# EasyEDA schematic 1-Schematic_LED Matrix.json

## Sheets
1 Audio: TITLE: Audio; REV: 1.0; Date: 2019-05-28; Sheet: 1/1; Drawn By: alecamar; Company: N/A
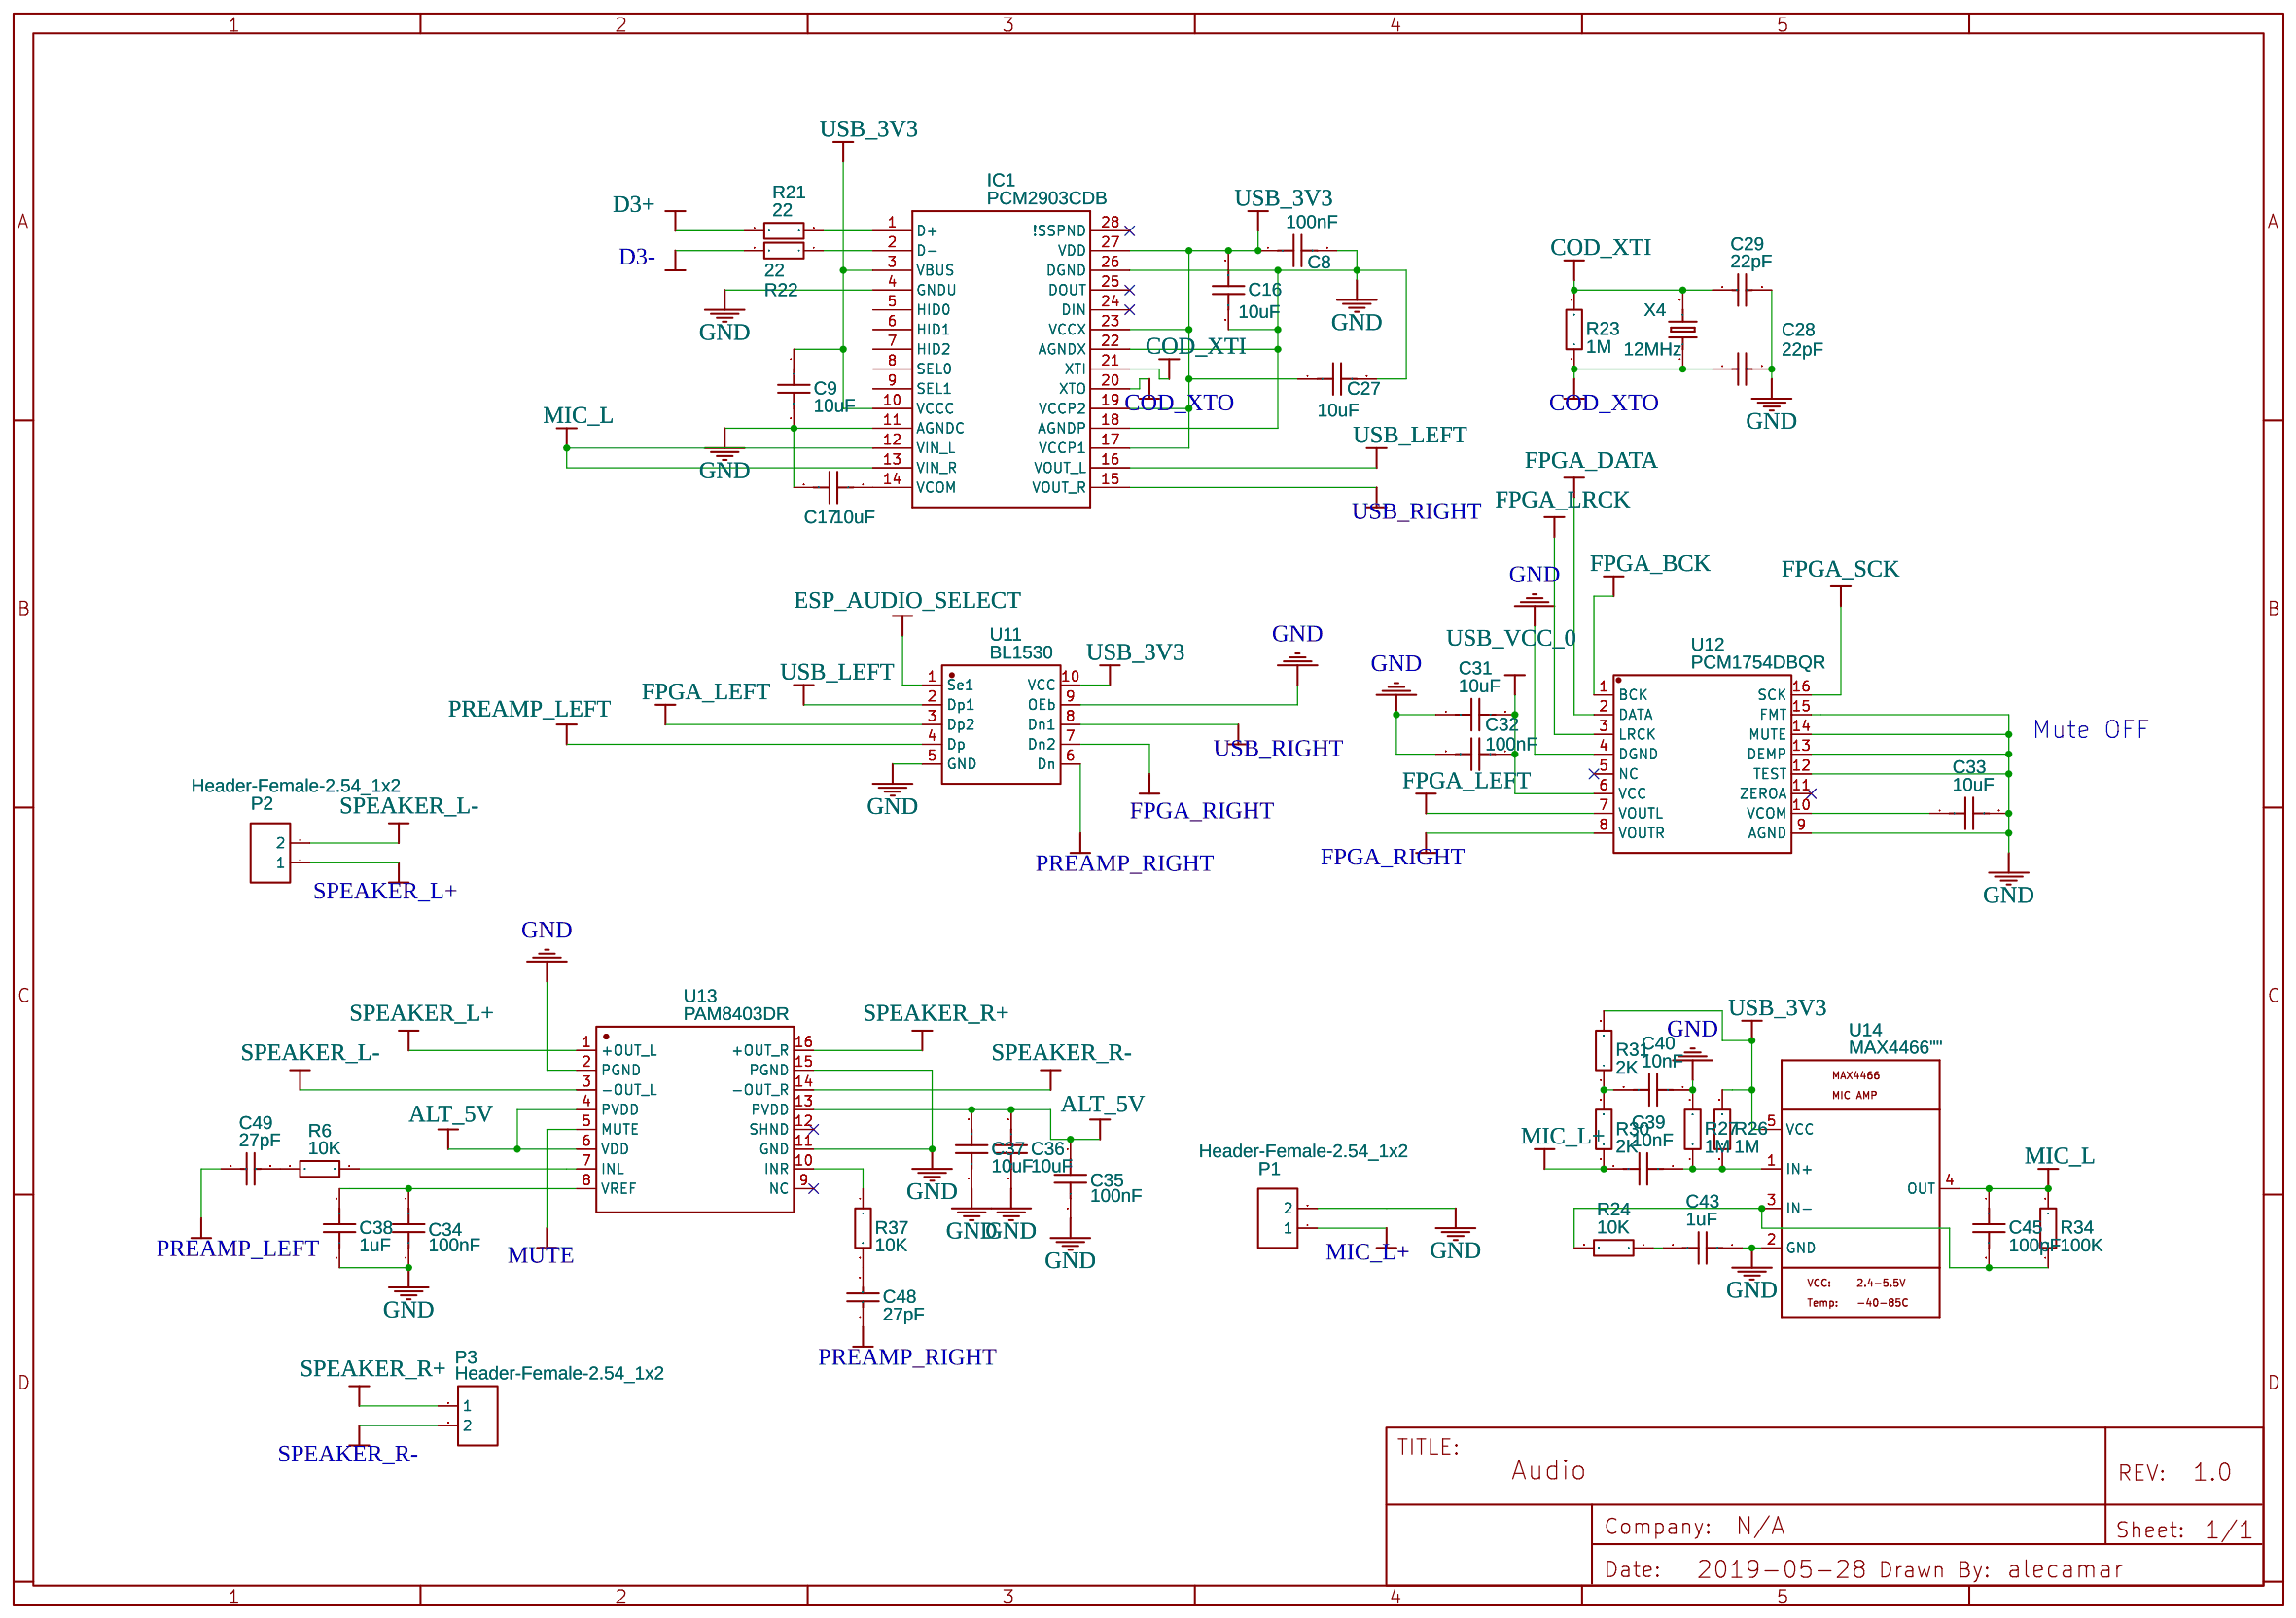
[diagram p0: Audio]
2 ESP: TITLE: ESP; Date: 2019-05-27
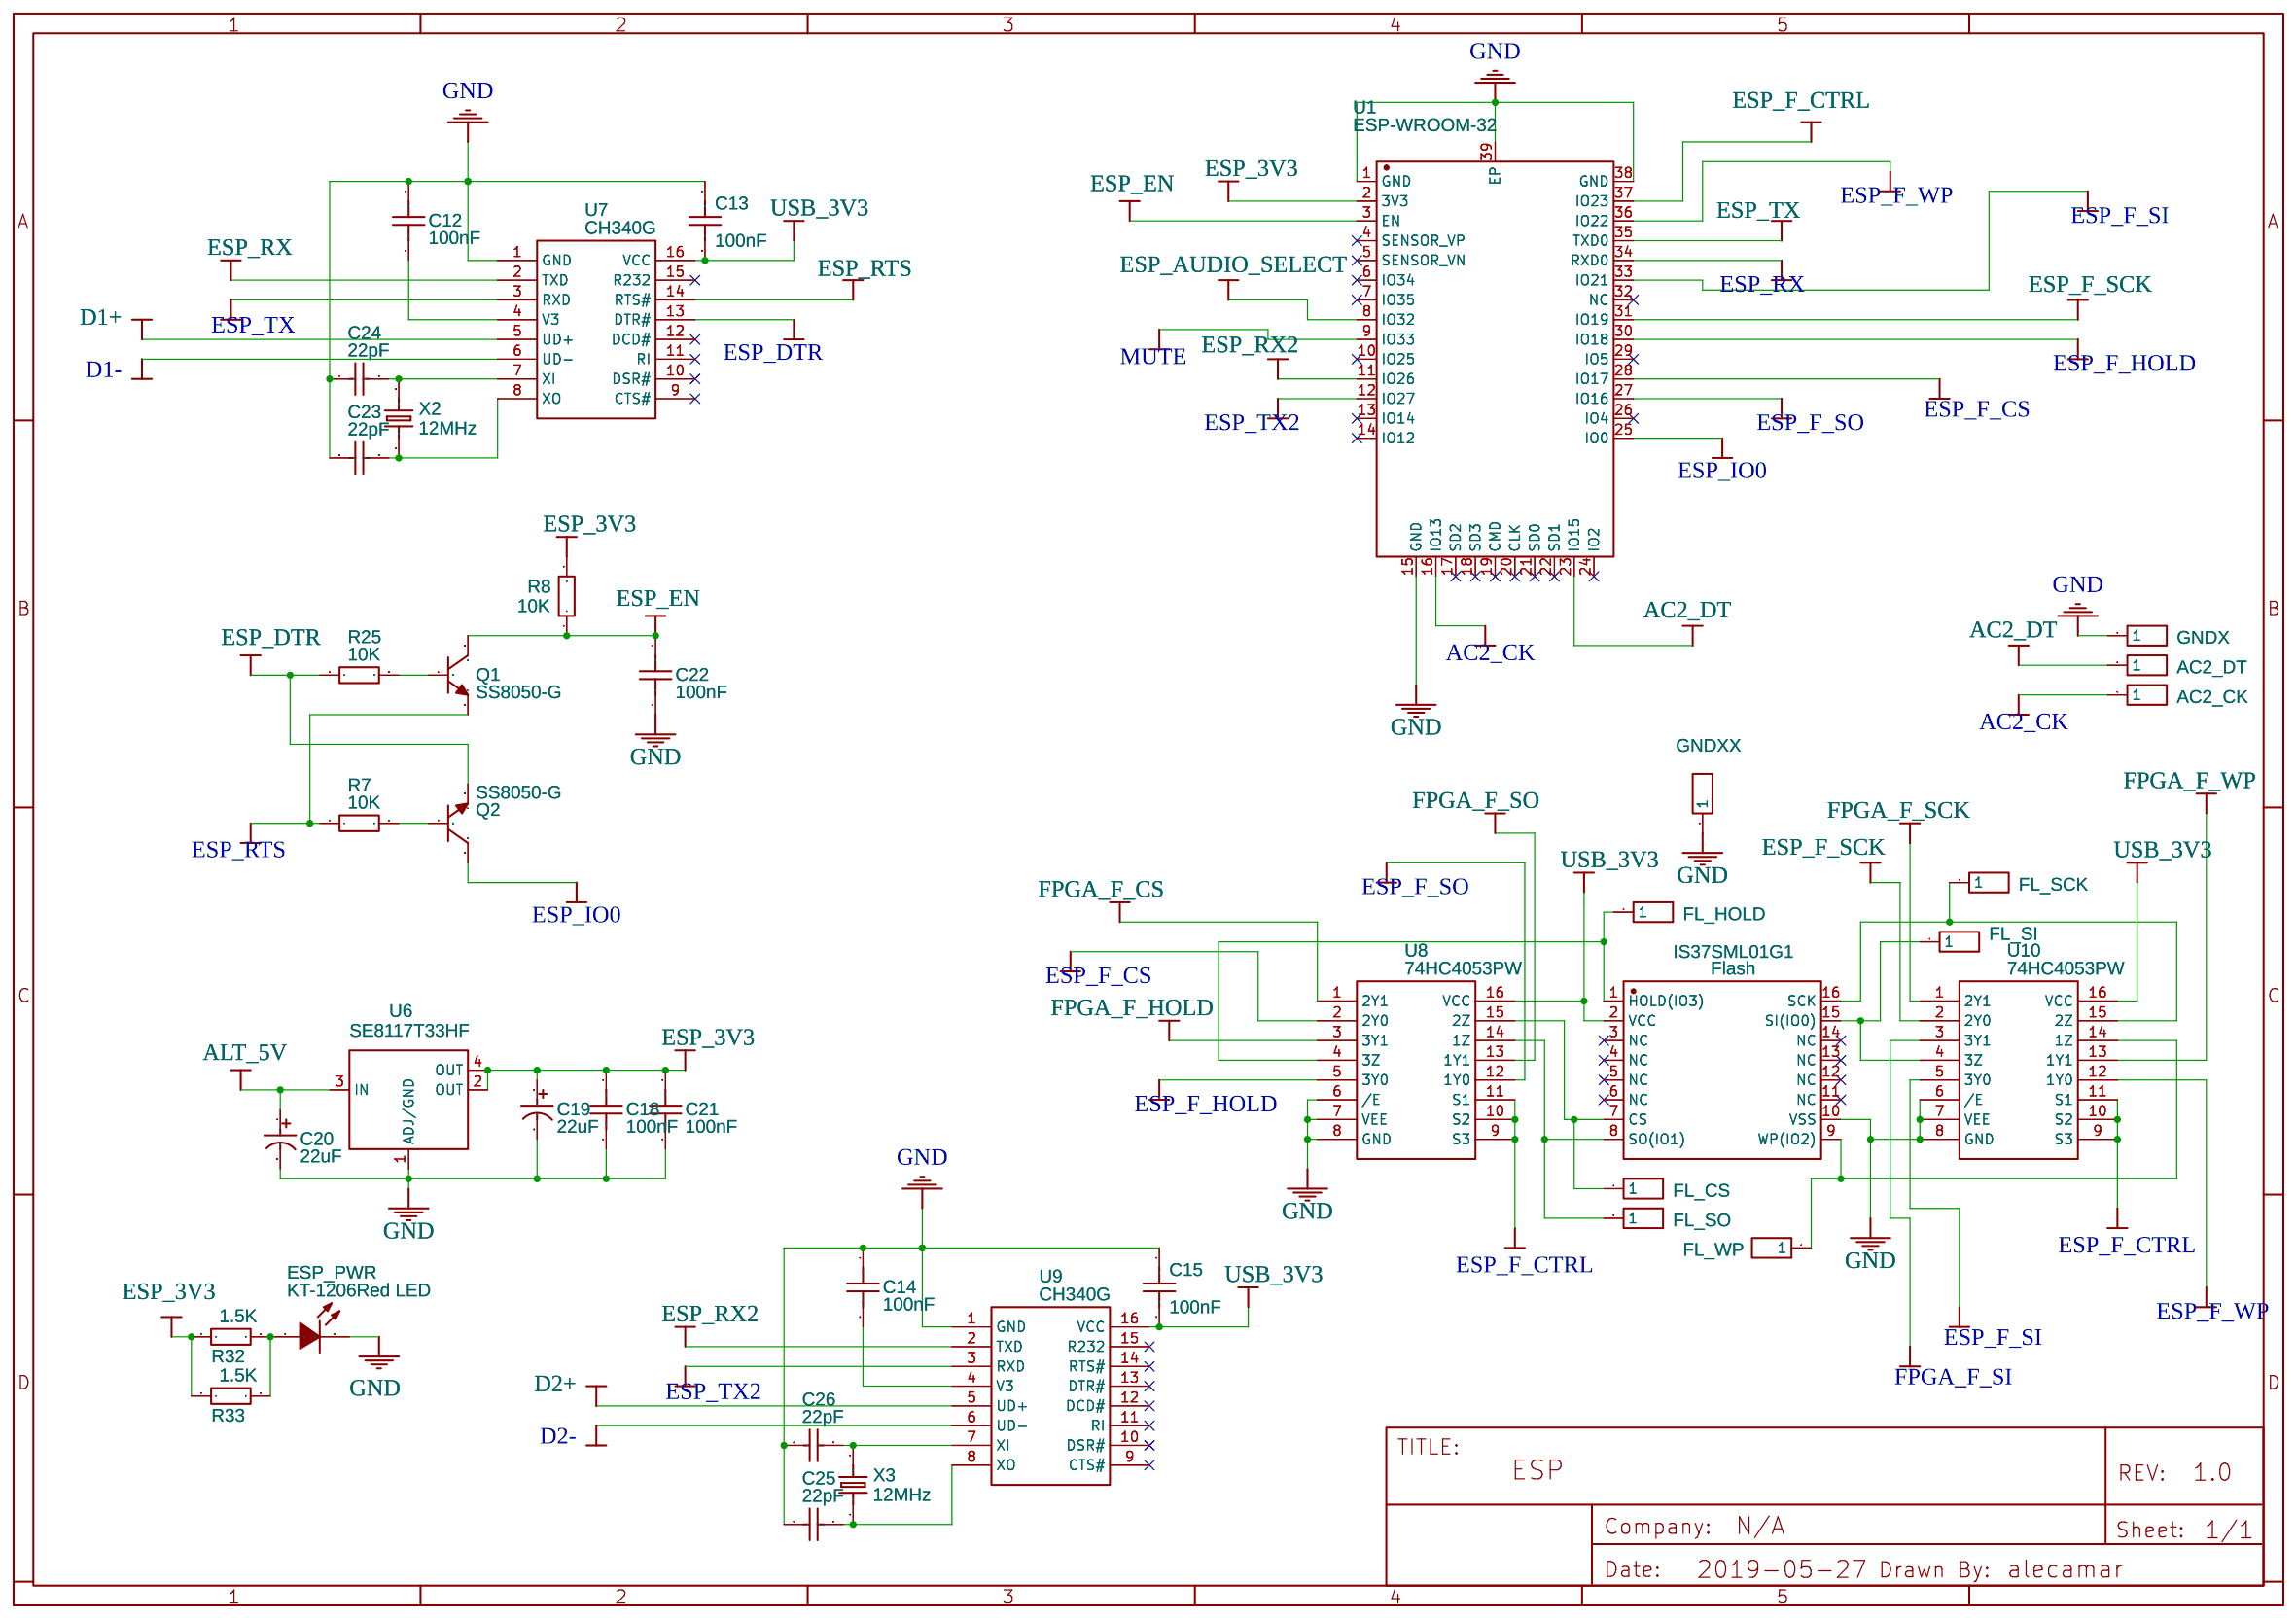
[diagram p1: ESP]
3 FPGA: TITLE: FPGA - MAX8; Date: 2019-05-24
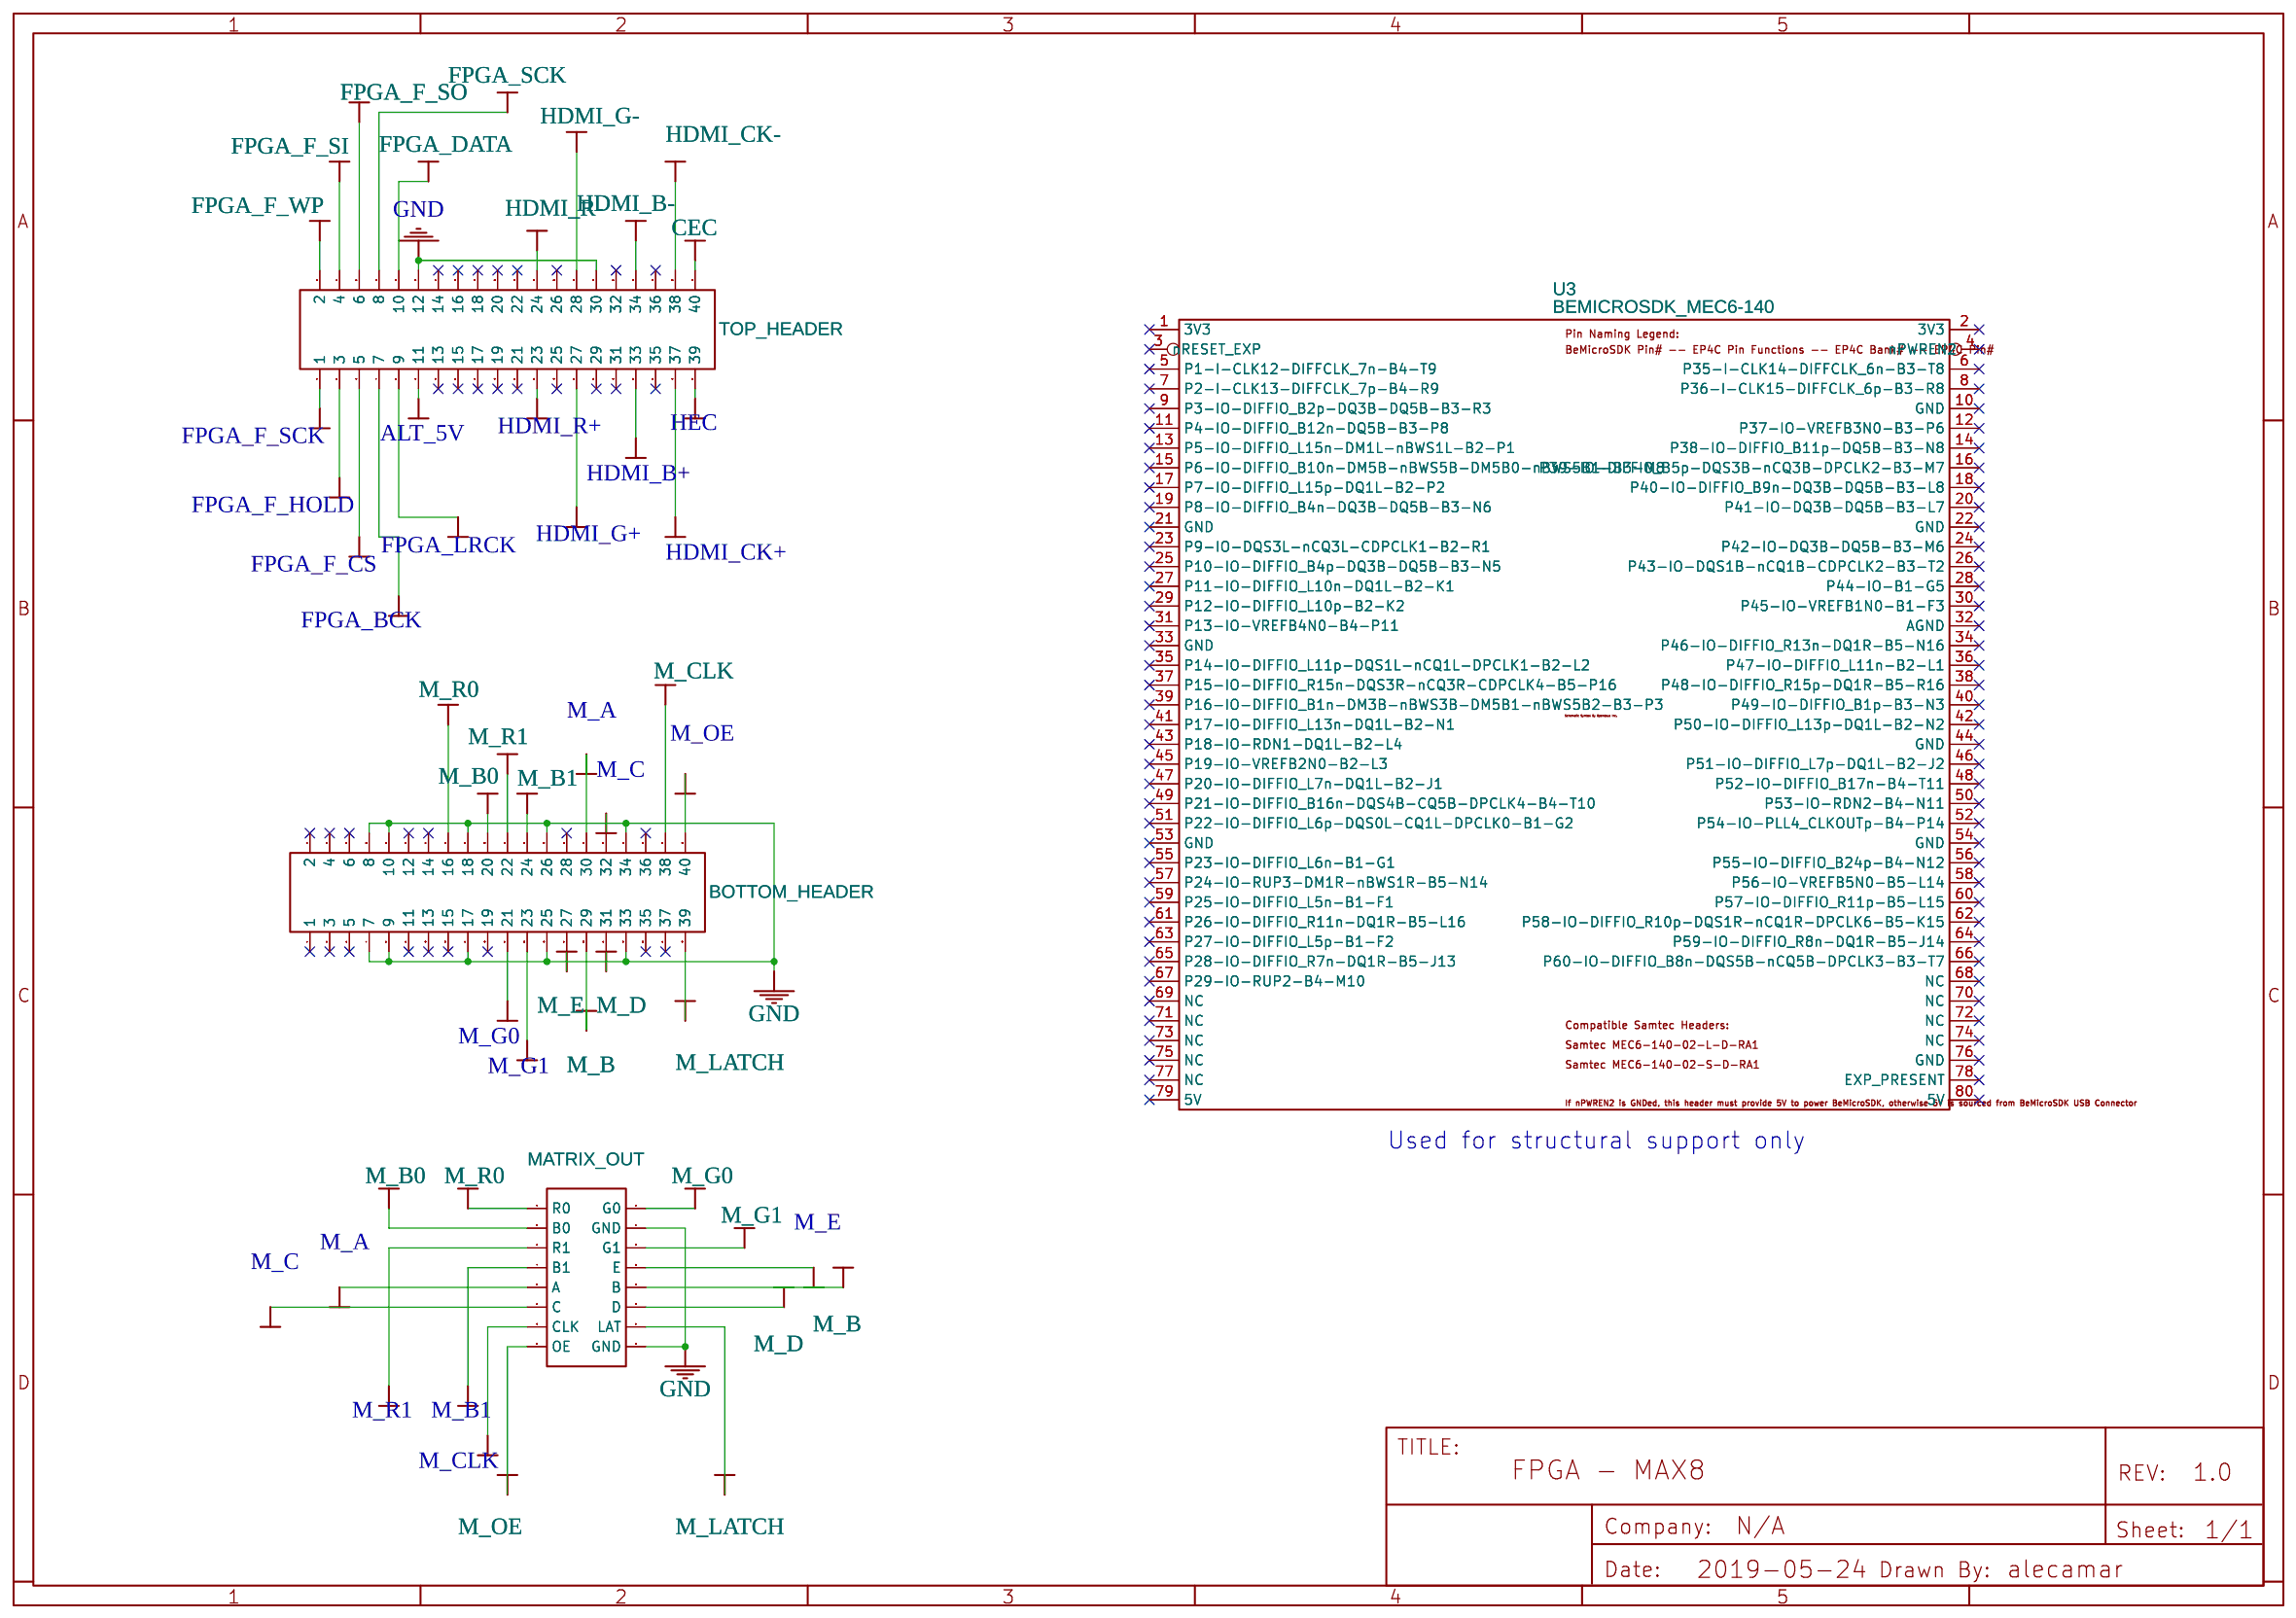
[diagram p2: FPGA]
4 IO: TITLE: HDMI; Date: 2019-05-20
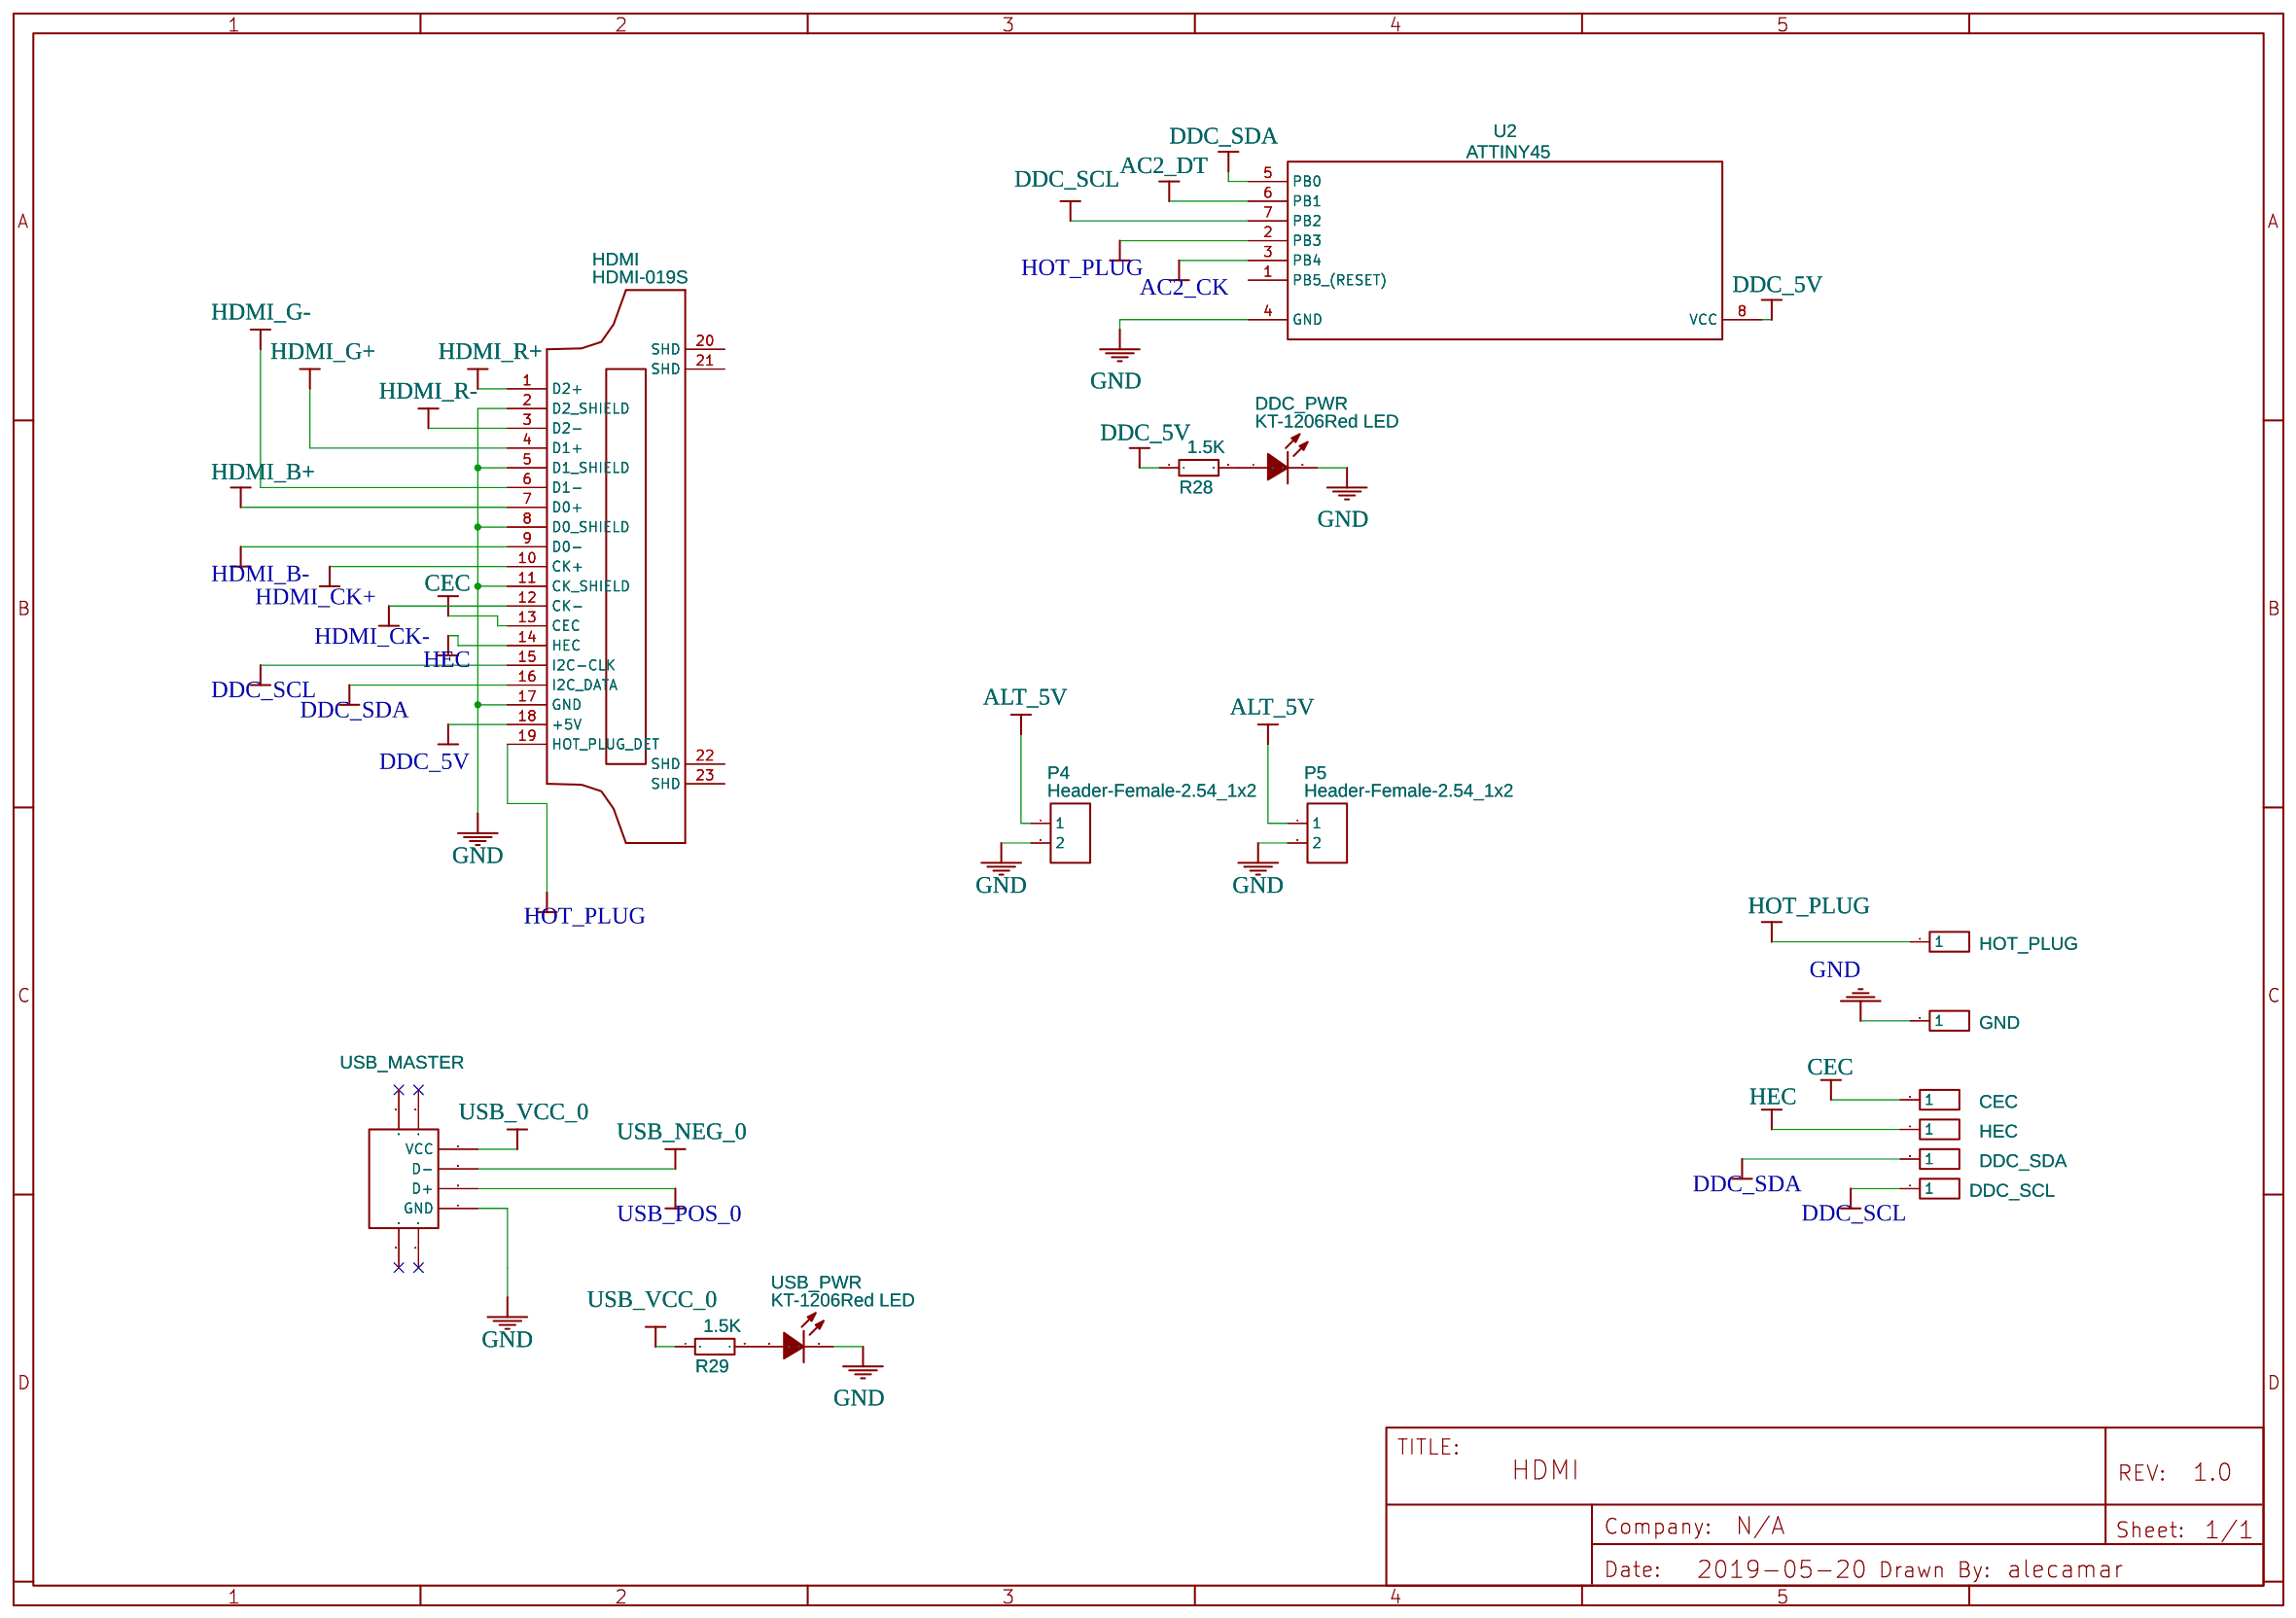
[diagram p3: IO]
5 USB_HUB: TITLE: USB_HUB; Date: 2019-05-27
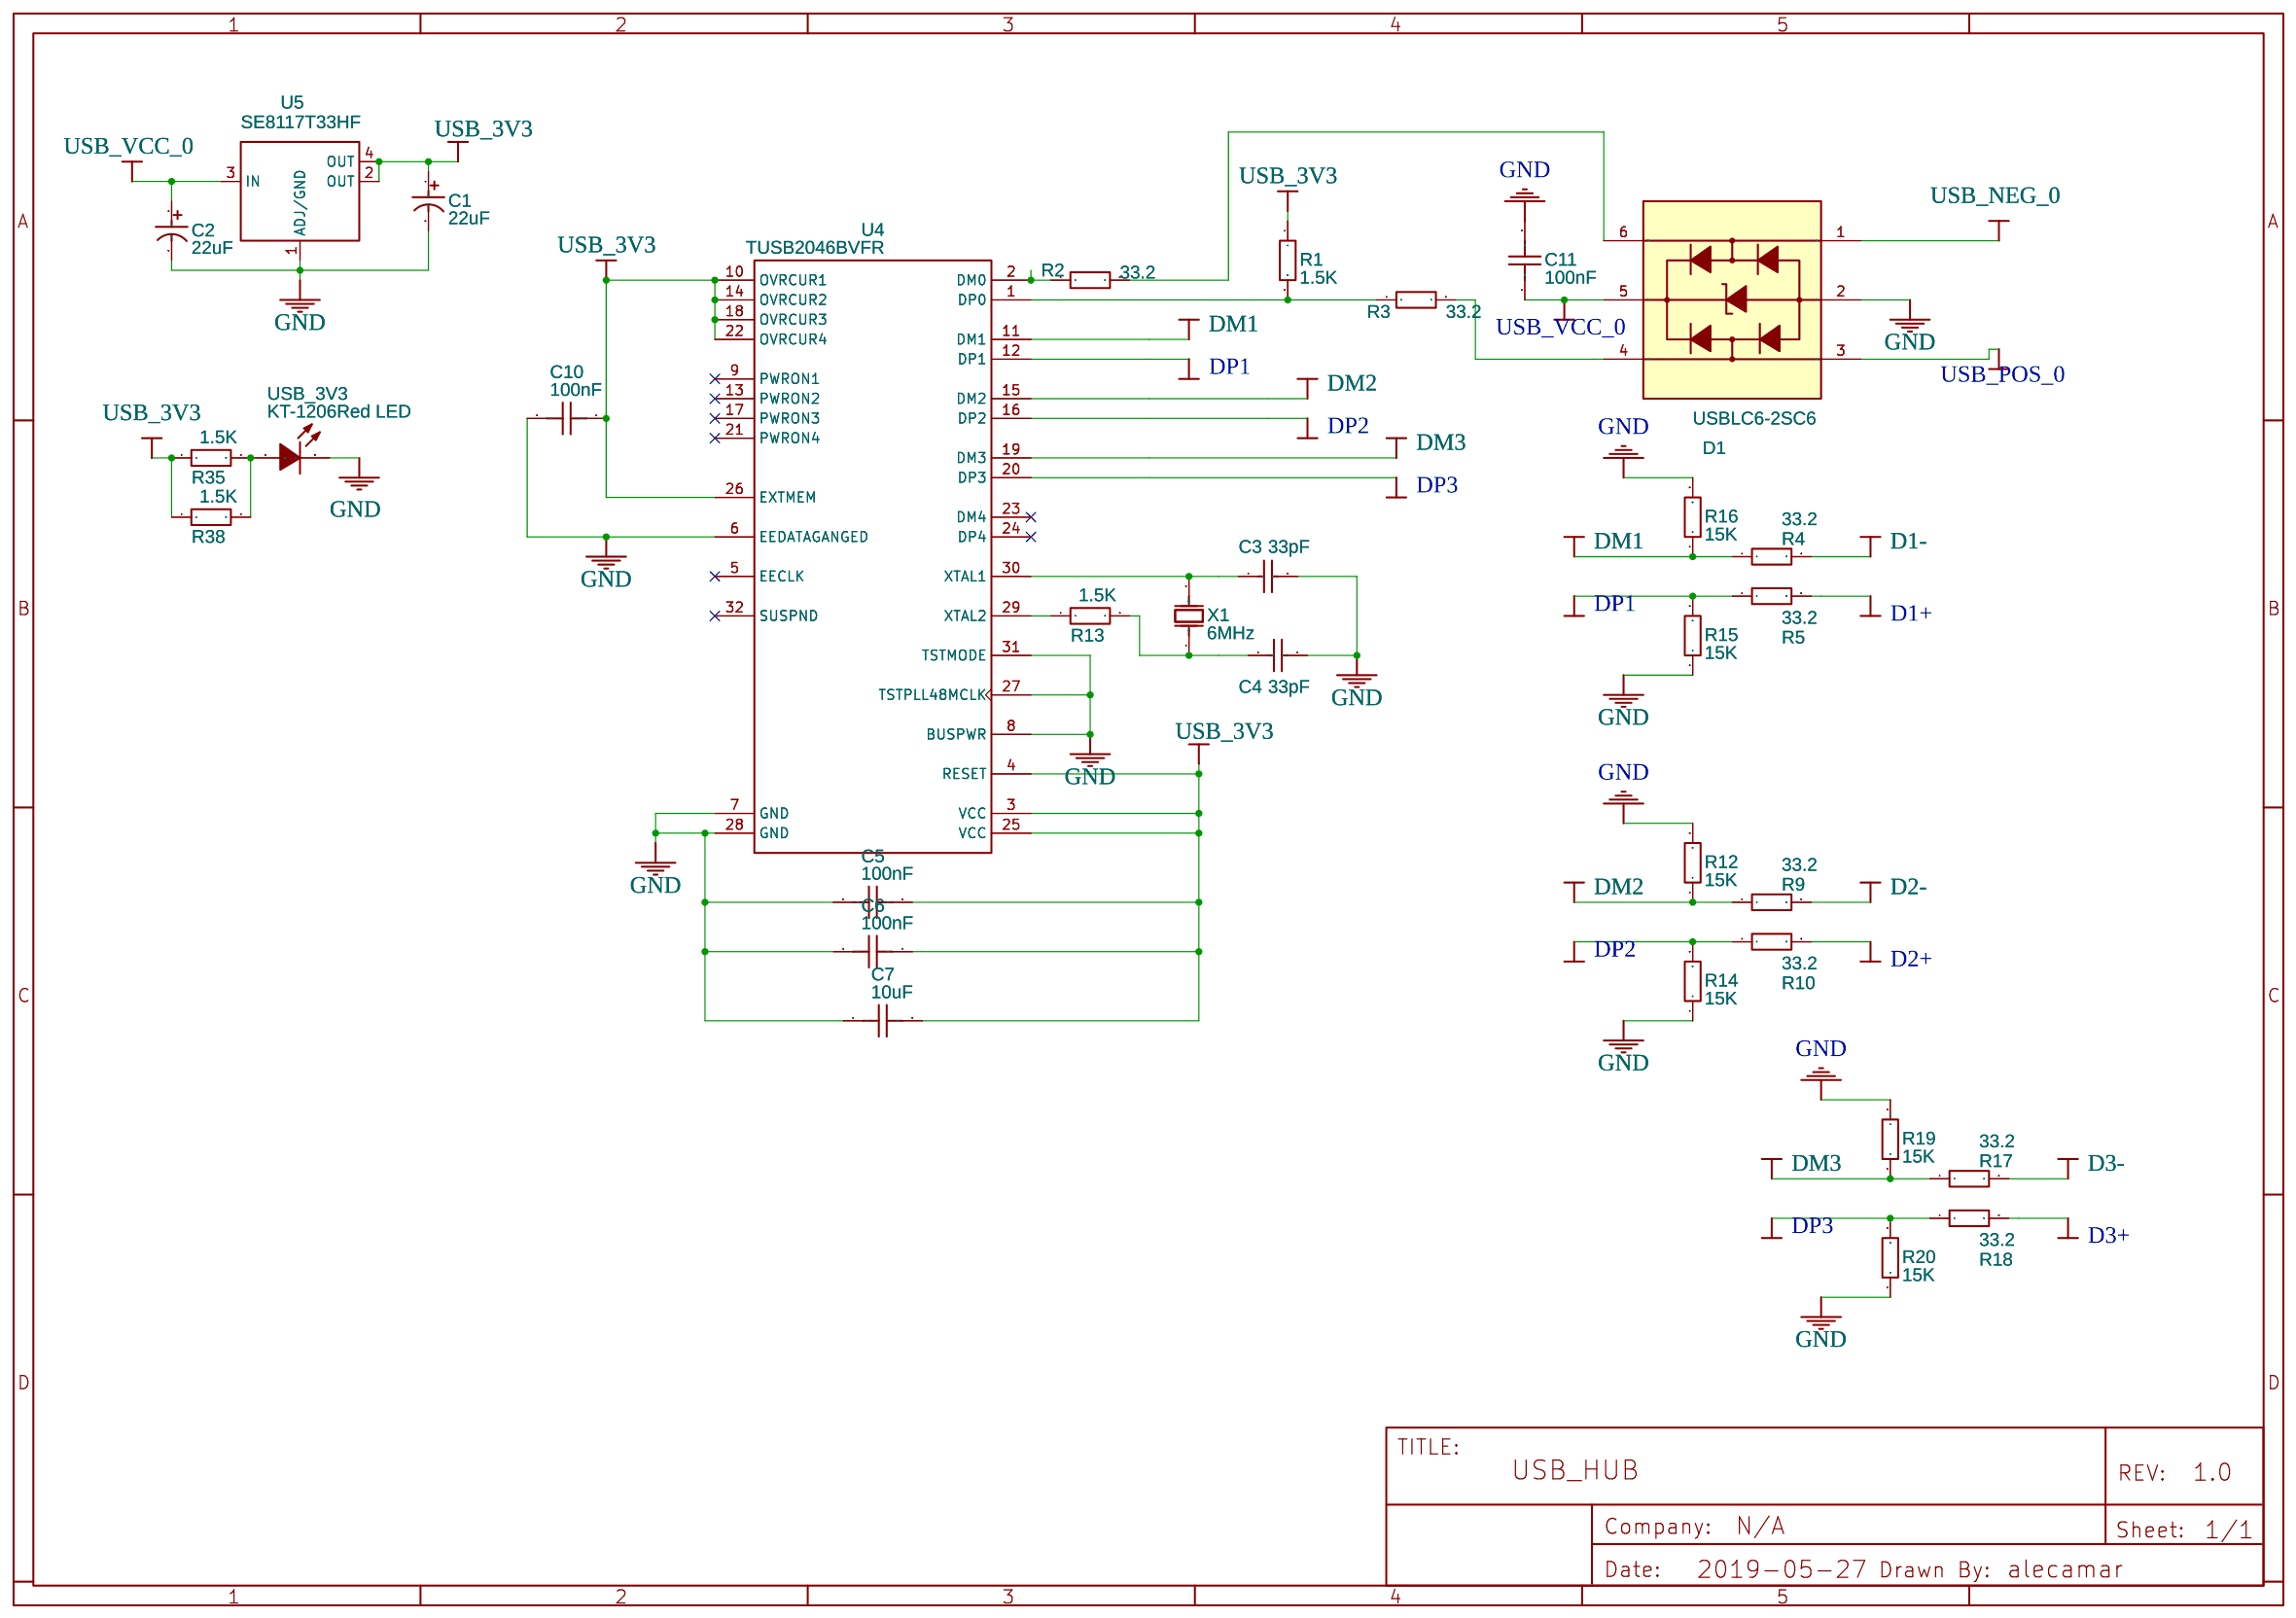
[diagram p4: USB_HUB]

## Parts
sheet Audio
C8  100nF  [1206]
C9  10uF  [1206]
C16  10uF  [1206]
C17  10uF  [1206]
C27  10uF  [1206]
C28  22pF  [1206]
C29  22pF  [1206]
C31  10uF  [1206]
C32  100nF  [1206]
C33  10uF  [1206]
C34  100nF  [1206]
C35  100nF  [1206]
C36  10uF  [1206]
C37  10uF  [1206]
C38  1uF  [1206]
C39  10nF  [1206]
C40  10nF  [1206]
C43  1uF  [1206]
C45  100pF  [1206]
C48  27pF  [1206]
C49  27pF  [1206]
IC1  PCM2903CDB  [SOP65P780X200-28N]
P1  Header-Female-2.54_1x2  [HDR-1X2/2.54]
P2  Header-Female-2.54_1x2  [HDR-1X2/2.54]
P3  Header-Female-2.54_1x2  [HDR-1X2/2.54]
R6  10K  [0805]
R21  22  [1206]
R22  22  [1206]
R23  1M  [1206]
R24  10K  [0805]
R26  1M  [1206]
R27  1M  [1206]
R30  2K  [1206]
R31  2K  [1206]
R34  100K  [1206]
R37  10K  [0805]
U11  BL1530  [MSOP-10L]
U12  PCM1754DBQR  [SSOP-16_150MIL]
U13  PAM8403DR  [SOIC-16_150MIL]
U14  MAX4466""  [SC70-5]
X4  12MHz  [HC-49S]
sheet ESP
AC2_CK  TestPoint  [HDR-1X1/2.54]
AC2_DT  TestPoint  [HDR-1X1/2.54]
C12  100nF  [1206]
C13  100nF  [1206]
C14  100nF  [1206]
C15  100nF  [1206]
C18  100nF  [1206]
C19  22uF  [CAP-D4.0XF1.5]
C20  22uF  [CAP-D4.0XF1.5]
C21  100nF  [1206]
C22  100nF  [1206]
C23  22pF  [1206]
C24  22pF  [1206]
C25  22pF  [1206]
C26  22pF  [1206]
ESP_PWR  KT-1206Red LED  [LED-1206]
FL_CS  TestPoint  [HDR-1X1/2.54]
FL_HOLD  TestPoint  [HDR-1X1/2.54]
FL_SCK  TestPoint  [HDR-1X1/2.54]
FL_SI  TestPoint  [HDR-1X1/2.54]
FL_SO  TestPoint  [HDR-1X1/2.54]
FL_WP  TestPoint  [HDR-1X1/2.54]
GNDX  TestPoint  [HDR-1X1/2.54]
GNDXX  TestPoint  [HDR-1X1/2.54]
IS37SML01G1  Flash  [SOIC-16_300MIL]
Q1  SS8050-G  [SOT-23(SOT-23-3)]
Q2  SS8050-G  [SOT-23(SOT-23-3)]
R7  10K  [1210]
R8  10K  [1210]
R25  10K  [1210]
R32  1.5K  [1206]
R33  1.5K  [1206]
U1  ESP-WROOM-32  [ESP-WROOM-32]
U6  SE8117T33HF  [SOT-223]
U7  CH340G  [SOIC-16_150MIL]
U8  74HC4053PW  [TSSOP-16]
U9  CH340G  [SOIC-16_150MIL]
U10  74HC4053PW  [TSSOP-16]
X2  12MHz  [HC-49S]
X3  12MHz  [HC-49S]
sheet FPGA
BOTTOM_HEADER  Header-Male-2.54_2x20  [HDR-20X2/2.54]
MATRIX_OUT  MATRIX_OUT  [HDR-8X2/2.54]
TOP_HEADER  Header-Mal0  [HDR-20X2/2.54]
U3  BEMICROSDK_MEC6-140  [MEC6-140]
sheet IO
CEC  TestPoint  [HDR-1X1/2.54]
DDC_PWR  KT-1206Red LED  [LED-1206]
DDC_SCL  TestPoint  [HDR-1X1/2.54]
DDC_SDA  TestPoint  [HDR-1X1/2.54]
GND  TestPoint  [HDR-1X1/2.54]
HDMI  HDMI-019S  [HDMI-019S]
HEC  TestPoint  [HDR-1X1/2.54]
HOT_PLUG  TestPoint  [HDR-1X1/2.54]
P4  Header-Female-2.54_1x2  [HDR-1X2/2.54]
P5  Header-Female-2.54_1x2  [HDR-1X2/2.54]
R28  1.5K  [1206]
R29  1.5K  [1206]
U2  ATTINY45  [DIP-8]
USB_MASTER  A  [USB-M-24]
USB_PWR  KT-1206Red LED  [LED-1206]
sheet USB_HUB
C1  22uF  [CAP-D4.0XF1.5]
C2  22uF  [CAP-D4.0XF1.5]
C3  33pF  [1206]
C4  33pF  [1206]
C5  100nF  [1206]
C6  100nF  [1206]
C7  10uF  [1206]
C10  100nF  [1206]
C11  100nF  [1206]
D1  USBLC6-2SC6  [SOT-23-6]
R1  1.5K  [1206]
R2  33.2  [1206]
R3  33.2  [1206]
R4  33.2  [1206]
R5  33.2  [1206]
R9  33.2  [1206]
R10  33.2  [1206]
R12  15K  [1206]
R13  1.5K  [1206]
R14  15K  [1206]
R15  15K  [1206]
R16  15K  [1206]
R17  33.2  [1206]
R18  33.2  [1206]
R19  15K  [1206]
R20  15K  [1206]
R35  1.5K  [1206]
R38  1.5K  [1206]
U4  TUSB2046BVFR  [VF32]
U5  SE8117T33HF  [SOT-223]
USB_3V3  KT-1206Red LED  [LED-1206]
X1  6MHz  [HC-49SMD]

## Library data of the parts
C5 C6 C8 C10-C15 C18 C21 C22 C32 C34 C35 = GRM319R71H104KA01D: Supplier: LCSC; Manufacturer: MuRata; Supplier Part: C86047
C7 C9 C16 C17 C27 C31 C33 C36 C37 = GRM31MB31A106KE18L: Supplier: LCSC; Supplier Part: C162498; Manufacturer: Murata Electronics; Contributor: LCSC
C23-C26 C28 C29 = 1206CG220J500NT: Supplier: LCSC; Manufacturer: FH; Supplier Part: C1896
C38 C43 = C1206C105M4RAC7800: Supplier: LCSC; Supplier Part: C141188; Manufacturer: KEMET; Contributor: LCSC
C39 C40 = TCC1206X7R103K102FT: Supplier: LCSC; Supplier Part: C344191; Manufacturer: CCTC; Contributor: LCSC
C45 = CL31C101JGFNNNE: Supplier: LCSC; Manufacturer: SAMSUNG; Contributor: LCSC; Supplier Part: C159750; LCSC Assembly: Yes; SMT Type: Extend
C48 C49 = 1206CG270J500NT: Supplier: LCSC; Manufacturer: FH; Supplier Part: C1899
IC1 = -: Contributor: merlinuk11; Manufacturer Part: ?
P1-P5 = -: Supplier: LCSC; Manufacturer: BOOMELE; Manufacturer Part: 2.54-1*2PFemale; image: //image.lceda.cn/szlcsc/C49661.jpg; Supplier Part: C49661
R6 R24 R37 = TC0525D1002T5E: Supplier: LCSC; Manufacturer: UniOhm; Supplier Part: C44791
R21 R22 = RMC1206225%N: Supplier: LCSC; Supplier Part: C325953; Manufacturer: Tyohm; Contributor: LCSC
R23 R26 R27 = RTT06105JTP: Supplier: LCSC; Manufacturer: RALEC; Supplier Part: C104604
R30 R31 = AR06BTCV2001: Supplier: LCSC; Supplier Part: C319708; Manufacturer: Viking Tech; Contributor: LCSC
R34 = AR06DTCV1003: Supplier: LCSC; Supplier Part: C319974; Manufacturer: Viking Tech; Contributor: LCSC
U11 = -: Supplier: LCSC; Supplier Part: C215758; Manufacturer: Shanghai Belling; Contributor: LCSC
U12 = -: Supplier: LCSC; Supplier Part: C294211; Manufacturer: Texas Instruments; Contributor: LCSC
U13 = -: Supplier Part: C17337; Supplier: LCSC; Manufacturer: DIODES; image: http://image.lceda.cn/szlcsc/C17337.jpg; LCSC Assembly: Yes; SMT Type: Extend
U14 = -: Contributor: Randall; Manufacturer Part: ?
X2-X4 = HC-49S12MHZ20PF30PPM: Supplier: LCSC; Manufacturer: TAE; Manufacturer Part: HC-49S12MHz20pF30PPM; Contributor: LCSC; Supplier Part: C127674
AC2_CK AC2_DT CEC DDC_SCL DDC_SDA FL_CS FL_HOLD FL_SCK FL_SI FL_SO FL_WP GND GNDX GNDXX HEC HOT_PLUG = -: Supplier: LCSC; Manufacturer: ReliaPro; Manufacturer Part: Header-Male-2.54_1x1; Supplier Part: C81276
C1 C2 C19 C20 = 22uF 16V 4*5: Supplier: LCSC; Manufacturer: ValuePro; Supplier Part: C43800
DDC_PWR ESP_PWR USB_3V3 USB_PWR = -: Supplier: LCSC; Manufacturer: KENTO; image: //image.lceda.cn/szlcsc/C49018.jpg; Supplier Part: C49018; LCSC Assembly: Yes; SMT Type: Extend
IS37SML01G1 = -: Supplier: LCSC; Contributor: LCSC
Q1 Q2 = -: Supplier: LCSC; Manufacturer: CJ; Contributor: LCSC; Supplier Part: C164886; LCSC Assembly: Yes; SMT Type: Extend
R7 R8 R25 = CR1210J30103G: Supplier: LCSC; Manufacturer: LIZ; Supplier Part: C102401
R13 R28 R29 R32 R33 R35 R38 = AC1206JR-071K5L: Supplier: LCSC; Manufacturer: YAGEO; Contributor: LCSC; Supplier Part: C144466
U1 = -: Supplier: LCSC; Manufacturer: ESPRESSIF; Supplier Part: C95209
U5 U6 = -: Supplier: LCSC; Manufacturer: SEAWARD; Supplier Part: C115002; LCSC Assembly: Yes; SMT Type: Extend
U7 U9 = -: Supplier: LCSC; Manufacturer: WCH; LCSC Assembly: Yes; image: //image.lceda.cn/szlcsc/C14267.jpg; Supplier Part: C14267; SMT Type: Basic
U8 U10 = -: Supplier: LCSC; Manufacturer: PHILIPS; image: //image.lceda.cn/szlcsc/C5648.jpg; Supplier Part: C5648; LCSC Assembly: Yes; SMT Type: Extend
BOTTOM_HEADER = -: Supplier: LCSC; Manufacturer: ReliaPro; image: http://image.lceda.cn/szlcsc/C50980.jpg; Supplier Part: C50980
MATRIX_OUT = -: Supplier: LCSC; Manufacturer: BOOMELE; Manufacturer Part: Double row straight 2*8Headers  Pins 2.54mm; image: //image.lceda.cn/szlcsc/C68234.jpg; Supplier Part: C68234
TOP_HEADER = -: Supplier: LCSC; Manufacturer: ReliaPro; Manufacturer Part: Header-Male-2.54_2x20; image: http://image.lceda.cn/szlcsc/C50980.jpg; Supplier Part: C50980
U3 = -: Manufacturer Part: ?; Package Display: No
HDMI = -: Supplier: LCSC; Manufacturer: SOFNG; Supplier Part: C111617
U2 = -: Supplier: LCSC; Manufacturer: MICROCHIP; Manufacturer Part: ATTINY45-20PU; Contributor: LCSC; Supplier Part: C152181
USB_MASTER = -: Supplier: LCSC; Manufacturer: ValuePro; Manufacturer Part: A/F90degree Aparagraph 10Four feet without curling ironPBTWhite plastic6.8; image: //image.lceda.cn/szlcsc/C42580.jpg; Supplier Part: C42580
C3 C4 = CC1206JKNPOCBN330: Supplier: LCSC; Manufacturer: YAGEO; Supplier Part: C85570
D1 = -: Supplier: LCSC; Manufacturer: STMicroelectronics; image: //image.lceda.cn/szlcsc/C7519.jpg; Supplier Part: C7519; LCSC Assembly: Yes; SMT Type: Extend
R1 = RTT061501FTP: Supplier: LCSC; Manufacturer: RALEC; Supplier Part: C104638
R2-R5 R9 R10 R17 R18 = RTT0633R2FTP: Supplier: LCSC; Supplier Part: C159577; Manufacturer: RALEC; Contributor: LCSC
R12 R14-R16 R19 R20 = RTT06153JTP: Supplier: LCSC; Manufacturer: RALEC; Supplier Part: C104645
U4 = -: 4-Port Full-Speed USB Hub, 3.3V, 0 to 70 degC, 32-Pin LQFP (VF), Green (RoHS  no SbBr); Manufacturer Part: ?
X1 = 6CS06000F20UCG: Supplier: LCSC; Supplier Part: C252308; Manufacturer: SHENZHEN CRYSTAL TECH; Contributor: LCSC

## Nets
GND: BOTTOM_HEADER.7 BOTTOM_HEADER.8 BOTTOM_HEADER.9 BOTTOM_HEADER.10 BOTTOM_HEADER.17 BOTTOM_HEADER.18 BOTTOM_HEADER.25 BOTTOM_HEADER.26 BOTTOM_HEADER.33 BOTTOM_HEADER.34 C1.2 C2.2 C3.2 C4.2 C5.1 C6.2 C7.1 C8.2 C9.2 C10.2 C11.2 C12.1 C13.1 C14.1 C15.1 C16.2 C17.2 C18.2 C19.2 C20.2 C21.2 C22.2 C23.1 C24.1 C25.1 C26.1 C27.2 C28.2 C29.2 C31.1 C32.2 C33.2 C34.2 C35.2 C36.1 C37.1 C38.1 C40.1 C43.1 D1.2 DDC_PWR.2(K) ESP_PWR.2(K) GND.1 GNDX.1 GNDXX.1 HDMI.2(D2_SHIELD) HDMI.5(D1_SHIELD) HDMI.8(D0_SHIELD) HDMI.11(CK_SHIELD) HDMI.17(GND) IC1.4(GNDU) IC1.11(AGNDC) IC1.18(AGNDP) IC1.22(AGNDX) IC1.26(DGND) IS37SML01G1.10(VSS) MATRIX_OUT.4(GND) MATRIX_OUT.16(GND) P1.2 P4.2 P5.2 R12.2 R14.1 R15.1 R16.2 R19.2 R20.1 R27.2 TOP_HEADER.12 TOP_HEADER.30 U1.1(GND) U1.15(GND) U1.38(GND) U1.39(EP) U2.4(GND) U4.6(EEDATAGANGED) U4.7(GND) U4.8(BUSPWR) U4.27(TSTPLL48MCLK) U4.28(GND) U4.31(TSTMODE) U5.1(ADJ/GND) U6.1(ADJ/GND) U7.1(GND) U8.6(/E) U8.7(VEE) U8.8(GND) U9.1(GND) U10.6(/E) U10.7(VEE) U10.8(GND) U11.5(GND) U11.9(OEb) U12.4(DGND) U12.9(AGND) U12.12(TEST) U12.13(DEMP) U12.14(MUTE) U12.15(FMT) U13.2(PGND) U13.11(GND) U13.15(PGND) U14.2(GND) USB_3V3.2(K) USB_MASTER.4(GND) USB_PWR.2(K)
AC2_CK: AC2_CK.1 U1.16(IO13) U2.3(PB4)
AC2_DT: AC2_DT.1 U1.23(IO15) U2.6(PB1)
ALT_5V: C20.1 C35.1 C36.2 C37.2 P4.1 P5.1 TOP_HEADER.11 U6.3(IN) U13.4(PVDD) U13.6(VDD) U13.13(PVDD)
CEC: CEC.1 HDMI.13(CEC) TOP_HEADER.40
COD_XTI: C29.1 IC1.21(XTI) R23.2 X4.2
COD_XTO: C28.1 IC1.20(XTO) R23.1 X4.1
D1+: R5.2 U7.5(UD+)
D1-: R4.2 U7.6(UD-)
D2+: R10.2 U9.5(UD+)
D2-: R9.2 U9.6(UD-)
D3+: R18.2 R21.1
D3-: R17.2 R22.2
DDC_5V: HDMI.18(+5V) R28.1 U2.8(VCC)
DDC_SCL: DDC_SCL.1 HDMI.15(I2C-CLK) U2.7(PB2)
DDC_SDA: DDC_SDA.1 HDMI.16(I2C_DATA) U2.5(PB0)
DM1: R4.1 R16.1 U4.11(DM1)
DM2: R9.1 R12.1 U4.15(DM2)
DM3: R17.1 R19.1 U4.19(DM3)
DP1: R5.1 R15.2 U4.12(DP1)
DP2: R10.1 R14.2 U4.16(DP2)
DP3: R18.1 R20.2 U4.20(DP3)
ESP_3V3: C18.1 C19.1 C21.1 R8.2 R32.1 R33.1 U1.2(3V3) U6.2(OUT) U6.4(OUT)
ESP_AUDIO_SELECT: U1.8(IO32) U11.1(Se1)
ESP_DTR: Q2.2(E) R25.1 U7.13(DTR#)
ESP_EN: C22.1 Q1.3(C) R8.1 U1.3(EN)
ESP_F_CS: U1.28(IO17) U8.2(2Y0)
ESP_F_CTRL: U1.37(IO23) U8.9(S3) U8.10(S2) U8.11(S1) U10.9(S3) U10.10(S2) U10.11(S1)
ESP_F_HOLD: U1.30(IO18) U8.5(3Y0)
ESP_F_SCK: U1.31(IO19) U10.2(2Y0)
ESP_F_SI: U1.33(IO21) U10.5(3Y0)
ESP_F_SO: U1.27(IO16) U8.12(1Y0)
ESP_F_WP: U1.36(IO22) U10.12(1Y0)
ESP_IO0: Q2.3(C) U1.25(IO0)
ESP_RTS: Q1.2(E) R7.1 U7.14(RTS#)
ESP_RX: U1.34(RXD0) U7.2(TXD)
ESP_RX2: U1.11(IO26) U9.2(TXD)
ESP_TX: U1.35(TXD0) U7.3(RXD)
ESP_TX2: U1.12(IO27) U9.3(RXD)
FPGA_BCK: TOP_HEADER.7 U12.1(BCK)
FPGA_DATA: TOP_HEADER.10 U12.2(DATA)
FPGA_F_CS: TOP_HEADER.5 U8.1(2Y1)
FPGA_F_HOLD: TOP_HEADER.3 U8.3(3Y1)
FPGA_F_SCK: TOP_HEADER.1 U10.1(2Y1)
FPGA_F_SI: TOP_HEADER.4 U10.3(3Y1)
FPGA_F_SO: TOP_HEADER.6 U8.13(1Y1)
FPGA_F_WP: TOP_HEADER.2 U10.13(1Y1)
FPGA_LEFT: U11.3(Dp2) U12.7(VOUTL)
FPGA_LRCK: TOP_HEADER.9 U12.3(LRCK)
FPGA_RIGHT: U11.7(Dn2) U12.8(VOUTR)
FPGA_SCK: TOP_HEADER.8 U12.16(SCK)
HDMI_B+: HDMI.7(D0+) TOP_HEADER.33
HDMI_B-: HDMI.9(D0-) TOP_HEADER.34
HDMI_CK+: HDMI.10(CK+) TOP_HEADER.37
HDMI_CK-: HDMI.12(CK-) TOP_HEADER.38
HDMI_G+: HDMI.4(D1+) TOP_HEADER.27
HDMI_G-: HDMI.6(D1-) TOP_HEADER.28
HDMI_R+: HDMI.1(D2+) TOP_HEADER.23
HDMI_R-: HDMI.3(D2-) TOP_HEADER.24
HEC: HDMI.14(HEC) HEC.1 TOP_HEADER.39
HOT_PLUG: HDMI.19(HOT_PLUG_DET) HOT_PLUG.1 U2.2(PB3)
M_A: BOTTOM_HEADER.30 MATRIX_OUT.9(A)
M_B: BOTTOM_HEADER.29 MATRIX_OUT.10(B)
M_B0: BOTTOM_HEADER.20 MATRIX_OUT.3(B0)
M_B1: BOTTOM_HEADER.24 MATRIX_OUT.7(B1)
M_C: BOTTOM_HEADER.32 MATRIX_OUT.11(C)
M_CLK: BOTTOM_HEADER.38 MATRIX_OUT.13(CLK)
M_D: BOTTOM_HEADER.31 MATRIX_OUT.12(D)
M_E: BOTTOM_HEADER.27 MATRIX_OUT.8(E)
M_G0: BOTTOM_HEADER.21 MATRIX_OUT.2(G0)
M_G1: BOTTOM_HEADER.23 MATRIX_OUT.6(G1)
M_LATCH: BOTTOM_HEADER.39 MATRIX_OUT.14(LAT)
M_OE: BOTTOM_HEADER.40 MATRIX_OUT.15(OE)
M_R0: BOTTOM_HEADER.16 MATRIX_OUT.1(R0)
M_R1: BOTTOM_HEADER.22 MATRIX_OUT.5(R1)
MIC_L: C45.1 IC1.12(VIN_L) IC1.13(VIN_R) R34.2 U14.4(OUT)
MIC_L+: C39.2 P1.1 R30.1
MUTE: U1.9(IO33) U13.5(MUTE)
PREAMP_LEFT: C49.2 U11.4(Dp)
PREAMP_RIGHT: C48.1 U11.6(Dn)
SPEAKER_L+: P2.1 U13.1(+OUT_L)
SPEAKER_L-: P2.2 U13.3(-OUT_L)
SPEAKER_R+: P3.1 U13.16(+OUT_R)
SPEAKER_R-: P3.2 U13.14(-OUT_R)
USB_3V3: C1.1 C5.2 C6.1 C7.2 C8.1 C9.1 C10.1 C13.2 C15.2 C16.1 C27.1 IC1.3(VBUS) IC1.10(VCCC) IC1.17(VCCP1) IC1.19(VCCP2) IC1.23(VCCX) IC1.27(VDD) IS37SML01G1.2(VCC) R1.1 R26.2 R31.2 R35.1 R38.1 U4.3(VCC) U4.4(RESET) U4.10(OVRCUR1) U4.14(OVRCUR2) U4.18(OVRCUR3) U4.22(OVRCUR4) U4.25(VCC) U4.26(EXTMEM) U5.2(OUT) U5.4(OUT) U7.16(VCC) U8.16(VCC) U9.16(VCC) U10.16(VCC) U11.10(VCC) U14.5(VCC)
USB_LEFT: IC1.16(VOUT_L) U11.2(Dp1)
USB_NEG_0: D1.1 USB_MASTER.2(D-)
USB_POS_0: D1.3 USB_MASTER.3(D+)
USB_RIGHT: IC1.15(VOUT_R) U11.8(Dn1)
USB_VCC_0: C2.1 C11.1 C31.2 C32.1 D1.5 R29.1 U5.3(IN) U12.6(VCC) USB_MASTER.1(VCC)
C4_1: C4.1 R13.2 X1.1(OSC1)
C40_2: C40.2 R30.2 R31.1
C43_2: C43.2 R24.1
DDC_PWR_1: DDC_PWR.1(A) R28.2
ESP_PWR_1: ESP_PWR.1(A) R32.2 R33.2
IC1_1: IC1.1(D+) R21.2
IC1_2: IC1.2(D-) R22.1
IC1_14: C17.1 IC1.14(VCOM)
IS37SML01G1_1: FL_HOLD.1 IS37SML01G1.1(HOLD(IO3)) U8.4(3Z)
IS37SML01G1_7: FL_CS.1 IS37SML01G1.7(CS) U8.15(2Z)
IS37SML01G1_8: FL_SO.1 IS37SML01G1.8(SO(IO1)) U8.14(1Z)
IS37SML01G1_9: FL_WP.1 IS37SML01G1.9(WP(IO2)) U10.14(1Z)
IS37SML01G1_15: FL_SI.1 IS37SML01G1.15(SI(IO0)) U10.4(3Z)
IS37SML01G1_16: FL_SCK.1 IS37SML01G1.16(SCK) U10.15(2Z)
Q1_1: Q1.1(B) R25.2
Q2_1: Q2.1(B) R7.2
R2_2: D1.6 R2.2
R3_2: D1.4 R3.2
R6_2: C49.1 R6.2
R37_2: C48.2 R37.2
U4_1: R1.2 R3.1 U4.1(DP0)
U4_2: R2.1 U4.2(DM0)
U4_29: R13.1 U4.29(XTAL2)
U4_30: C3.1 U4.30(XTAL1) X1.2(OSC2)
U7_4: C12.2 U7.4(V3)
U7_7: C24.2 U7.7(XI) X2.2
U7_8: C23.2 U7.8(XO) X2.1
U9_4: C14.2 U9.4(V3)
U9_7: C26.2 U9.7(XI) X3.2
U9_8: C25.2 U9.8(XO) X3.1
U12_10: C33.1 U12.10(VCOM)
U13_7: R6.1 U13.7(INL)
U13_8: C34.1 C38.2 U13.8(VREF)
U13_10: R37.1 U13.10(INR)
U14_1: C39.1 R26.1 R27.1 U14.1(IN+)
U14_3: C45.2 R24.2 R34.1 U14.3(IN-)
USB_3V3_1: R35.2 R38.2 USB_3V3.1(A)
USB_PWR_1: R29.2 USB_PWR.1(A)

Not connected (* = marked no-connect by the designer): BOTTOM_HEADER 1* 2* 3* 4* 5* 6* 11* 12* 13* 14* 15* 19* 28* 35* 36* 37*; HDMI 20(SHD) 21(SHD) 22(SHD) 23(SHD); IC1 5(HID0) 6(HID1) 7(HID2) 8(SEL0) 9(SEL1) 24(DIN)* 25(DOUT)* 28(!SSPND)*; IS37SML01G1 3(NC)* 4(NC)* 5(NC)* 6(NC)* 11(NC)* 12(NC)* 13(NC)* 14(NC)*; TOP_HEADER 13* 14* 15* 16* 17* 18* 19* 20* 21* 22* 25* 26* 29* 31* 32* 35* 36*; U1 4(SENSOR_VP)* 5(SENSOR_VN)* 6(IO34)* 7(IO35)* 10(IO25)* 13(IO14)* 14(IO12)* 17(SD2)* 18(SD3)* 19(CMD)* 20(CLK)* 21(SD0)* 22(SD1)* 24(IO2)* 26(IO4)* 29(IO5)* 32(NC)*; U2 1(PB5 (RESET)); U3 1(3V3)* 2(3V3)* 3(nRESET_EXP)* 4(nPWREN2)* 5(P1-I-CLK12-DIFFCLK_7n-B4-T9)* 6(P35-I-CLK14-DIFFCLK_6n-B3-T8)* 7(P2-I-CLK13-DIFFCLK_7p-B4-R9)* 8(P36-I-CLK15-DIFFCLK_6p-B3-R8)* 9(P3-IO-DIFFIO_B2p-DQ3B-DQ5B-B3-R3)* 10(GND)* 11(P4-IO-DIFFIO_B12n-DQ5B-B3-P8)* 12(P37-IO-VREFB3N0-B3-P6)* 13(P5-IO-DIFFIO_L15n-DM1L-nBWS1L-B2-P1)* 14(P38-IO-DIFFIO_B11p-DQ5B-B3-N8)* 15(P6-IO-DIFFIO_B10n-DM5B-nBWS5B-DM5B0-nBWS5B1-B3-M8)* 16(P39-IO-DIFFIO_B5p-DQS3B-nCQ3B-DPCLK2-B3-M7)* 17(P7-IO-DIFFIO_L15p-DQ1L-B2-P2)* 18(P40-IO-DIFFIO_B9n-DQ3B-DQ5B-B3-L8)* 19(P8-IO-DIFFIO_B4n-DQ3B-DQ5B-B3-N6)* 20(P41-IO-DQ3B-DQ5B-B3-L7)* 21(GND)* 22(GND)* 23(P9-IO-DQS3L-nCQ3L-CDPCLK1-B2-R1)* 24(P42-IO-DQ3B-DQ5B-B3-M6)* 25(P10-IO-DIFFIO_B4p-DQ3B-DQ5B-B3-N5)* 26(P43-IO-DQS1B-nCQ1B-CDPCLK2-B3-T2)* 27(P11-IO-DIFFIO_L10n-DQ1L-B2-K1)* 28(P44-IO-B1-G5)* 29(P12-IO-DIFFIO_L10p-B2-K2)* 30(P45-IO-VREFB1N0-B1-F3)* 31(P13-IO-VREFB4N0-B4-P11)* 32(AGND)* 33(GND)* 34(P46-IO-DIFFIO_R13n-DQ1R-B5-N16)* 35(P14-IO-DIFFIO_L11p-DQS1L-nCQ1L-DPCLK1-B2-L2)* 36(P47-IO-DIFFIO_L11n-B2-L1)* 37(P15-IO-DIFFIO_R15n-DQS3R-nCQ3R-CDPCLK4-B5-P16)* 38(P48-IO-DIFFIO_R15p-DQ1R-B5-R16)* 39(P16-IO-DIFFIO_B1n-DM3B-nBWS3B-DM5B1-nBWS5B2-B3-P3)* 40(P49-IO-DIFFIO_B1p-B3-N3)* 41(P17-IO-DIFFIO_L13n-DQ1L-B2-N1)* 42(P50-IO-DIFFIO_L13p-DQ1L-B2-N2)* 43(P18-IO-RDN1-DQ1L-B2-L4)* 44(GND)* 45(P19-IO-VREFB2N0-B2-L3)* 46(P51-IO-DIFFIO_L7p-DQ1L-B2-J2)* 47(P20-IO-DIFFIO_L7n-DQ1L-B2-J1)* 48(P52-IO-DIFFIO_B17n-B4-T11)* 49(P21-IO-DIFFIO_B16n-DQS4B-CQ5B-DPCLK4-B4-T10)* 50(P53-IO-RDN2-B4-N11)* 51(P22-IO-DIFFIO_L6p-DQS0L-CQ1L-DPCLK0-B1-G2)* 52(P54-IO-PLL4_CLKOUTp-B4-P14)* 53(GND)* 54(GND)* 55(P23-IO-DIFFIO_L6n-B1-G1)* 56(P55-IO-DIFFIO_B24p-B4-N12)* 57(P24-IO-RUP3-DM1R-nBWS1R-B5-N14)* 58(P56-IO-VREFB5N0-B5-L14)* 59(P25-IO-DIFFIO_L5n-B1-F1)* 60(P57-IO-DIFFIO_R11p-B5-L15)* 61(P26-IO-DIFFIO_R11n-DQ1R-B5-L16)* 62(P58-IO-DIFFIO_R10p-DQS1R-nCQ1R-DPCLK6-B5-K15)* 63(P27-IO-DIFFIO_L5p-B1-F2)* 64(P59-IO-DIFFIO_R8n-DQ1R-B5-J14)* 65(P28-IO-DIFFIO_R7n-DQ1R-B5-J13)* 66(P60-IO-DIFFIO_B8n-DQS5B-nCQ5B-DPCLK3-B3-T7)* 67(P29-IO-RUP2-B4-M10)* 68(NC)* 69(NC)* 70(NC)* 71(NC)* 72(NC)* 73(NC)* 74(NC)* 75(NC)* 76(GND)* 77(NC)* 78(EXP_PRESENT)* 79(5V)* 80(5V)*; U4 5(EECLK)* 9(PWRON1)* 13(PWRON2)* 17(PWRON3)* 21(PWRON4)* 23(DM4)* 24(DP4)* 32(SUSPND)*; U7 9(CTS#)* 10(DSR#)* 11(RI)* 12(DCD#)* 15(R232)*; U9 9(CTS#)* 10(DSR#)* 11(RI)* 12(DCD#)* 13(DTR#)* 14(RTS#)* 15(R232)*; U12 5(NC)* 11(ZEROA)*; U13 9(NC)* 12(SHND)*; USB_MASTER 0*

## Notes on the sheets
sheet 1
- Mute OFF
sheet 3
- Used for structural support only
